# EasyEDA schematic 1-Schematic_NRF24L01P-R.json
TITLE: Sheet_1; REV: 1.0; Date: 2024-05-07; Sheet: 1/1; Drawn By: mem; Company: Your Company
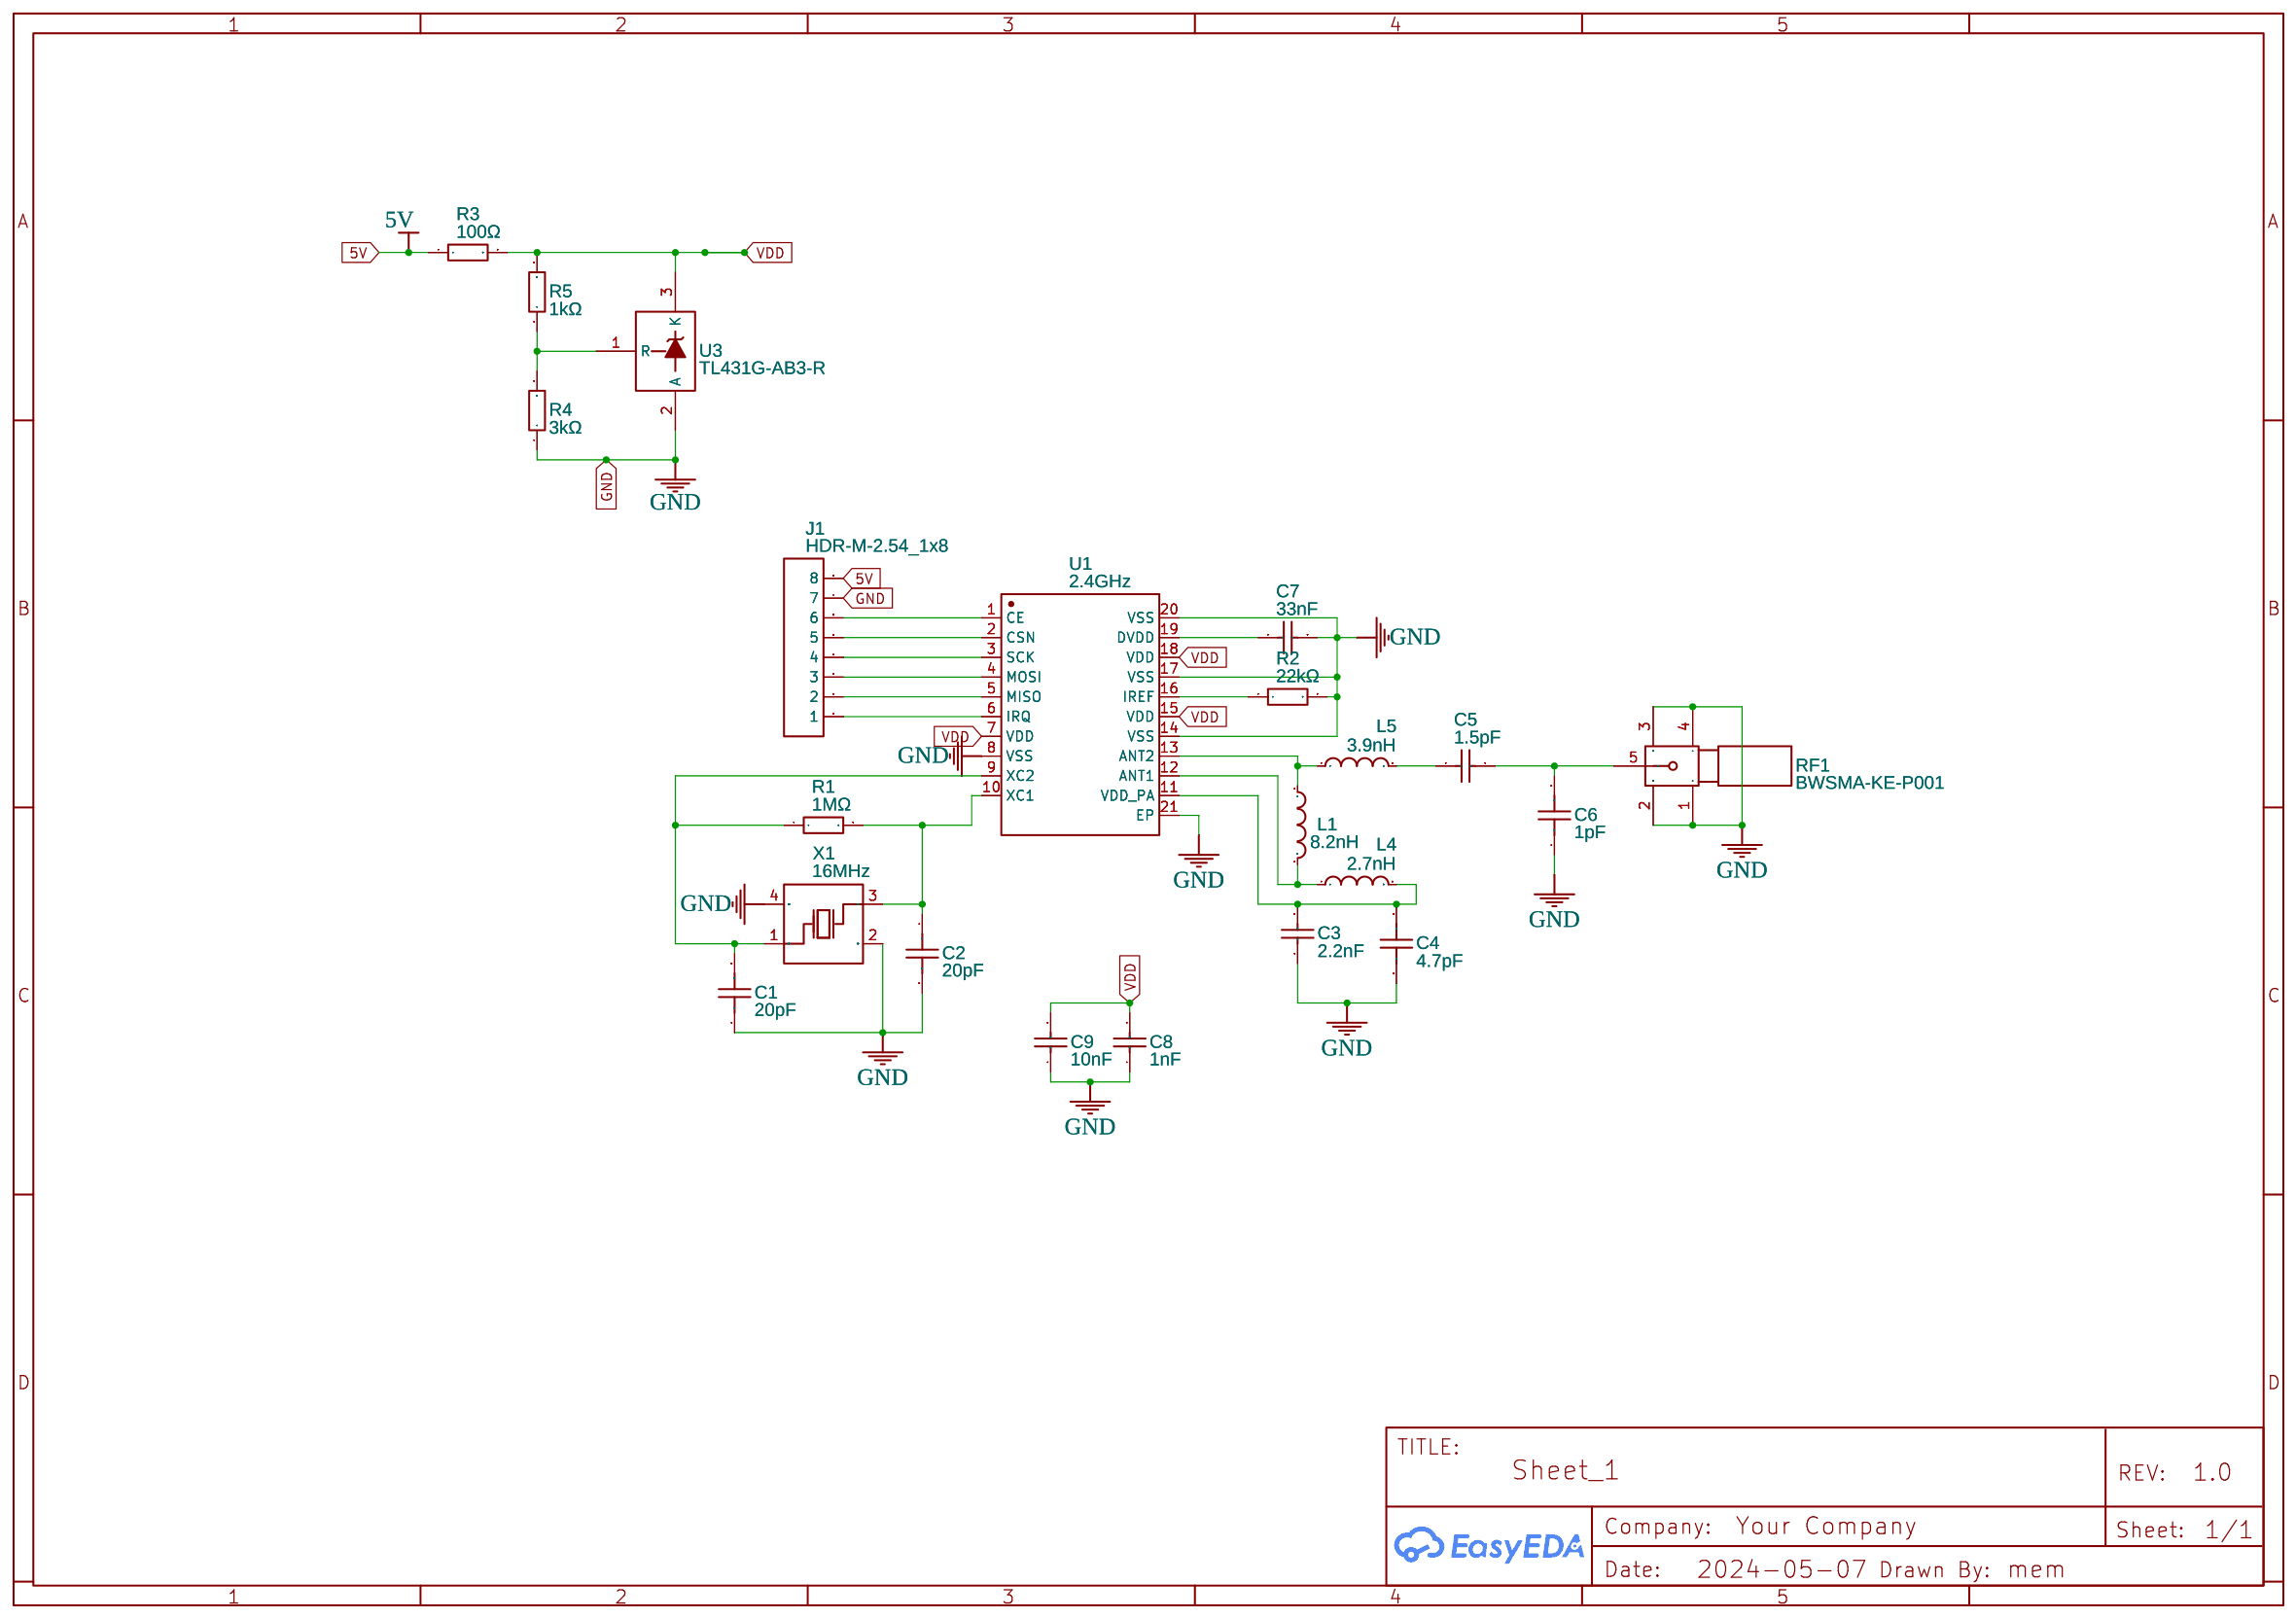
[diagram p0: schematic sheet]

## Parts
C1  20pF  [C0805]
C2  20pF  [C0805]
C3  2.2nF  [C0805]
C4  4.7pF  [C0805]
C5  1.5pF  [C0603]
C6  1pF  [C0805]
C7  33nF  [C0805]
C8  1nF  [C0805]
C9  10nF  [C0805]
J1  HDR-M-2.54_1x8  [HDR-M-2.54_1X8]
L1  8.2nH  [L0805]
L4  2.7nH  [L0805]
L5  3.9nH  [L0805]
R1  1MΩ  [R0805]
R2  22kΩ  [R0805]
R3  100Ω  [R1206]
R4  3kΩ  [R1206]
R5  1kΩ  [R1206]
RF1  BWSMA-KE-P001  [SMA-SMD_BWSMA-KE-P001]
U1  2.4GHz  [QFN-20_L4.0-W4.0-P0.50-BL-EP]
U3  TL431G-AB3-R  [SOT-89-3_L4.5-W2.5-P1.50-LS4.2-BR]
X1  16MHz  [OSC-SMD_4P-L3.2-W2.5-BL]

## Library data of the parts
C1 C2 = CC0805GRNPO9BN200: Contributor: LCSC; Supplier: LCSC; Supplier Part: C520066; Manufacturer: YAGEO(国巨); JLCPCB Part Class: Extended Part
C3 = 0805B222K500NT: Supplier: LCSC; Manufacturer: FH(风华); Supplier Part: C36576; JLCPCB Part Class: Extended Part
C4 = CC0805BRNPO9BN4R7: Contributor: LCSC; Supplier: LCSC; Supplier Part: C519993; Manufacturer: YAGEO(国巨); JLCPCB Part Class: Extended Part
C5 = 0603CG1R5C500NT: Supplier: LCSC; Manufacturer: FH(风华); Supplier Part: C1639; JLCPCB Part Class: Extended Part
C6 = CC0805BRNPO9BN1R0: Contributor: LCSC; Supplier: LCSC; Supplier Part: C519982; Manufacturer: YAGEO(国巨); JLCPCB Part Class: Extended Part
C7 = CC0805KRX7R9BB333: Supplier: LCSC; Manufacturer: YAGEO(国巨); Supplier Part: C107150; JLCPCB Part Class: Extended Part
C8 = 0805B102K500NT: Supplier: LCSC; Manufacturer: FH(风华); Supplier Part: C46553; JLCPCB Part Class: Extended Part
C9 = 0805B103K500NT: Supplier: LCSC; Manufacturer: FH(风华); Supplier Part: C52278; JLCPCB Part Class: Extended Part
J1 = HDR-M-2.54_1x8: Supplier Part: C190820; Supplier: LCSC; Contributor: LCEDA_Lib
L1 = VHF201209H8N2J: Supplier: LCSC; Manufacturer: FH(风华); Supplier Part: C98986; JLCPCB Part Class: Extended Part
L4 = SCHF201209H2N7ST: Contributor: LCSC; Supplier: LCSC; Supplier Part: C578018; Manufacturer: Yanchuang(研创); JLCPCB Part Class: Extended Part
L5 = SCHF201209H3N9ST: Contributor: LCSC; Supplier: LCSC; Supplier Part: C578020; Manufacturer: Yanchuang(研创); JLCPCB Part Class: Extended Part
R1 = 0805W8F1004T5E: Supplier: LCSC; Manufacturer: UNI-ROYAL(厚声); Supplier Part: C17514; JLCPCB Part Class: Basic Part
R2 = 0805W8F2202T5E: Supplier: LCSC; Manufacturer: UNI-ROYAL(厚声); Supplier Part: C17560; JLCPCB Part Class: Basic Part
R3 = 1206W4F1000T5E: Supplier: LCSC; Manufacturer: UNI-ROYAL(厚声); Supplier Part: C17901; JLCPCB Part Class: Basic Part
R4 = 1206W4F3001T5E: Supplier: LCSC; Manufacturer: UNI-ROYAL(厚声); Supplier Part: C18012; JLCPCB Part Class: Extended Part
R5 = 1206W4F1001T5E: Supplier: LCSC; Manufacturer: UNI-ROYAL(厚声); Supplier Part: C4410; JLCPCB Part Class: Basic Part
RF1 = BWSMA-KE-P001: Contributor: LCSC; Supplier: LCSC; Supplier Part: C496550; Manufacturer: BAT WIRELESS(蝙蝠无线); JLCPCB Part Class: Extended Part
U1 = NRF24L01P-R: Supplier: LCSC; Manufacturer: NORDIC; Supplier Part: C8791; JLCPCB Part Class: Extended Part
U3 = TL431G-AB3-R: Supplier: LCSC; Manufacturer: UTC(友顺); Supplier Part: C71128; JLCPCB Part Class: Extended Part
X1 = X322516MLB4SI: Supplier: LCSC; Manufacturer: YXC(扬兴晶振); Supplier Part: C13738; JLCPCB Part Class: Basic Part

## Nets
5V: J1.8 R3.1
GND: C1.1 C2.2 C3.1 C4.1 C6.1 C7.2 C8.1 C9.1 J1.7 R2.2 R4.1 RF1.1 RF1.2 RF1.3 RF1.4 U1.8(VSS) U1.14(VSS) U1.17(VSS) U1.20(VSS) U1.21(EP) U3.2(A) X1.2(GND) X1.4(GND)
VDD: C8.2 C9.2 R3.2 R5.2 U1.7(VDD) U1.15(VDD) U1.18(VDD) U3.3(K)
Net-(C1-2): C1.2 R1.1 U1.9(XC2) X1.1(OSC1)
Net-(C2-1): C2.1 R1.2 U1.10(XC1) X1.3(OSC2)
Net-(C3-2): C3.2 C4.2 L4.2 U1.11(VDD_PA)
Net-(C5-1): C5.1 L5.2
Net-(C5-2): C5.2 C6.2 RF1.5
Net-(C7-1): C7.1 U1.19(DVDD)
Net-(J1-1): J1.1 U1.6(IRQ)
Net-(J1-2): J1.2 U1.5(MISO)
Net-(J1-3): J1.3 U1.4(MOSI)
Net-(J1-4): J1.4 U1.3(SCK)
Net-(J1-5): J1.5 U1.2(CSN)
Net-(J1-6): J1.6 U1.1(CE)
Net-(L1-1): L1.1 L5.1 U1.13(ANT2)
Net-(L1-2): L1.2 L4.1 U1.12(ANT1)
Net-(R2-1): R2.1 U1.16(IREF)
Net-(R4-2): R4.2 R5.1 U3.1(R)
